# EAGLE schematic rx_sensor (EAGLE 6.5.0)
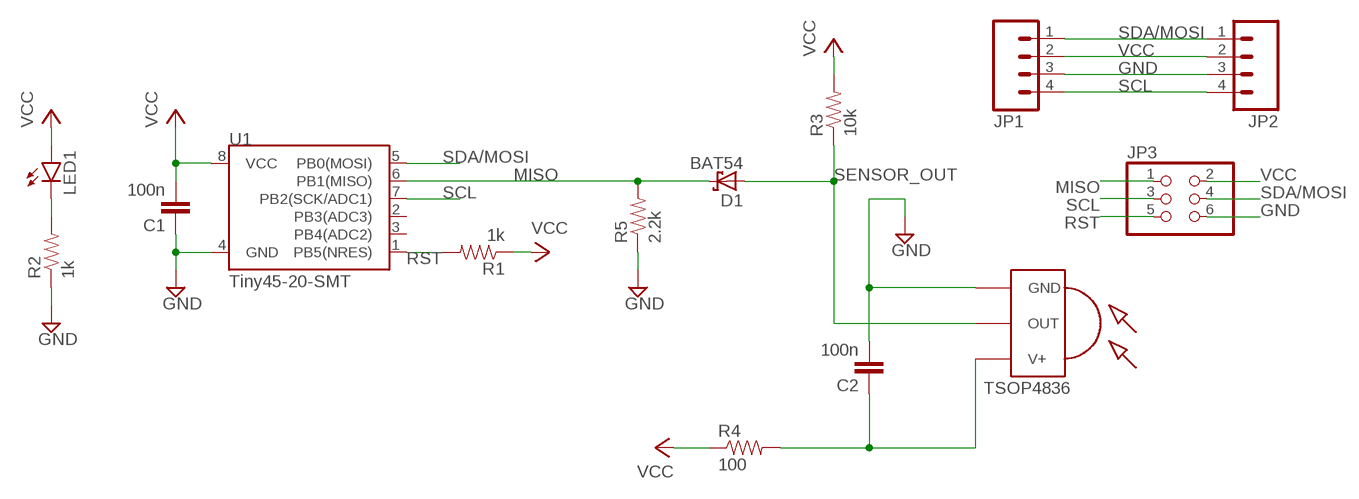
[diagram p0: schematic, sheet 1]

## Parts
C1  100n  CAP0603-CAP  [0603-CAP]
C2  100n  CAP0603-CAP  [0603-CAP]
D1  BAT54  [SOT23]
JP1  M04JST-PTH  [JST-4-PTH]
JP2  M04JST-PTH  [JST-4-PTH]
JP3  PINHD-2X3  [2X03]
LED1  LED0603  [LED-0603]
R1  1k  RESISTOR0603  [0603-RES]
R2  1k  RESISTOR0603  [0603-RES]
R3  10k  RESISTOR0603  [0603-RES]
R4  100  RESISTOR0603  [0603-RES]
R5  2.2k  RESISTOR0603  [0603-RES]
TSOP4836  TSOP4836  [TSOP18XX]
U1  Tiny45-20-SMT  ATTINY45TINY45-20-SMT  [SO08-EIAJ]

## Nets
GND: C1.1 C2.2 JP1.3 JP2.3 JP3.6 R2.1 R5.1 TSOP4836.GND U1.4(GND)
MISO: D1.3(C) JP3.1 R5.2 U1.6(PB1(MISO))
N$1: LED1.C R2.2
N$2: C2.1 R4.2 TSOP4836.VCC(V+)
RST: JP3.5 R1.2 U1.1(PB5(NRES))
SCL: JP1.4 JP2.4 JP3.3 U1.7(PB2(SCK/ADC1))
SDA/MOSI: JP1.1 JP2.1 JP3.4 U1.5(PB0(MOSI))
SENSOR_OUT: D1.1(A) R3.1 TSOP4836.OUT
VCC: C1.2 JP1.2 JP2.2 JP3.2 LED1.A R1.1 R3.2 R4.1 U1.8(VCC)
Unconnected: U1.2(PB3(ADC3)) U1.3(PB4(ADC2))

## Library data of the parts
C1 C2 = SparkFun-Capacitors:CAP: Capacitor Standard 0603 ceramic capacitor, and 0.1" leaded capacitor.
D1 = diode:BAT54: Schottky Diodes Source: Fairchild .. BAT54.pdf
JP1 JP2 = SparkFun-Connectors:M04: Header 4 Standard 4-pin 0.1" header. Use with straight break away headers (SKU : PRT-00116), right angle break away headers (PRT-00553), swiss pins (PRT-00743), machine pins (PRT-00117), and female headers (PRT-00115). Molex polarized connector foot print use with SKU : PRT-08231 with associated crimp pins and housings. 1MM SMD Version SKU: PRT-10208; SKU: PRT-09916
JP3 = pinhead:PINHD-2X3: PIN HEADER
LED1 = SparkFun-LED:LED: LEDs Standard schematic elements and footprints for 5mm, 3mm, 1206, and 0603 sized LEDs. 5mm - Spark Fun Electronics SKU : COM-00529 (and others)
R1-R5 = SparkFun-Resistors:RESISTOR: Resistor Basic schematic elements and footprints for 0603, 1206, and PTH resistors.
TSOP4836 = tsop-1:TSOP4836: IR Receiver and Demodulator
U1 = SparkFun-DigitalIC:ATTINY45: Atmel 8-pin 2/4/8kB flash uC; PROD_ID: IC-08922